# Altium schematic sheet Sheet.schdoc
size 249 x 199 mm
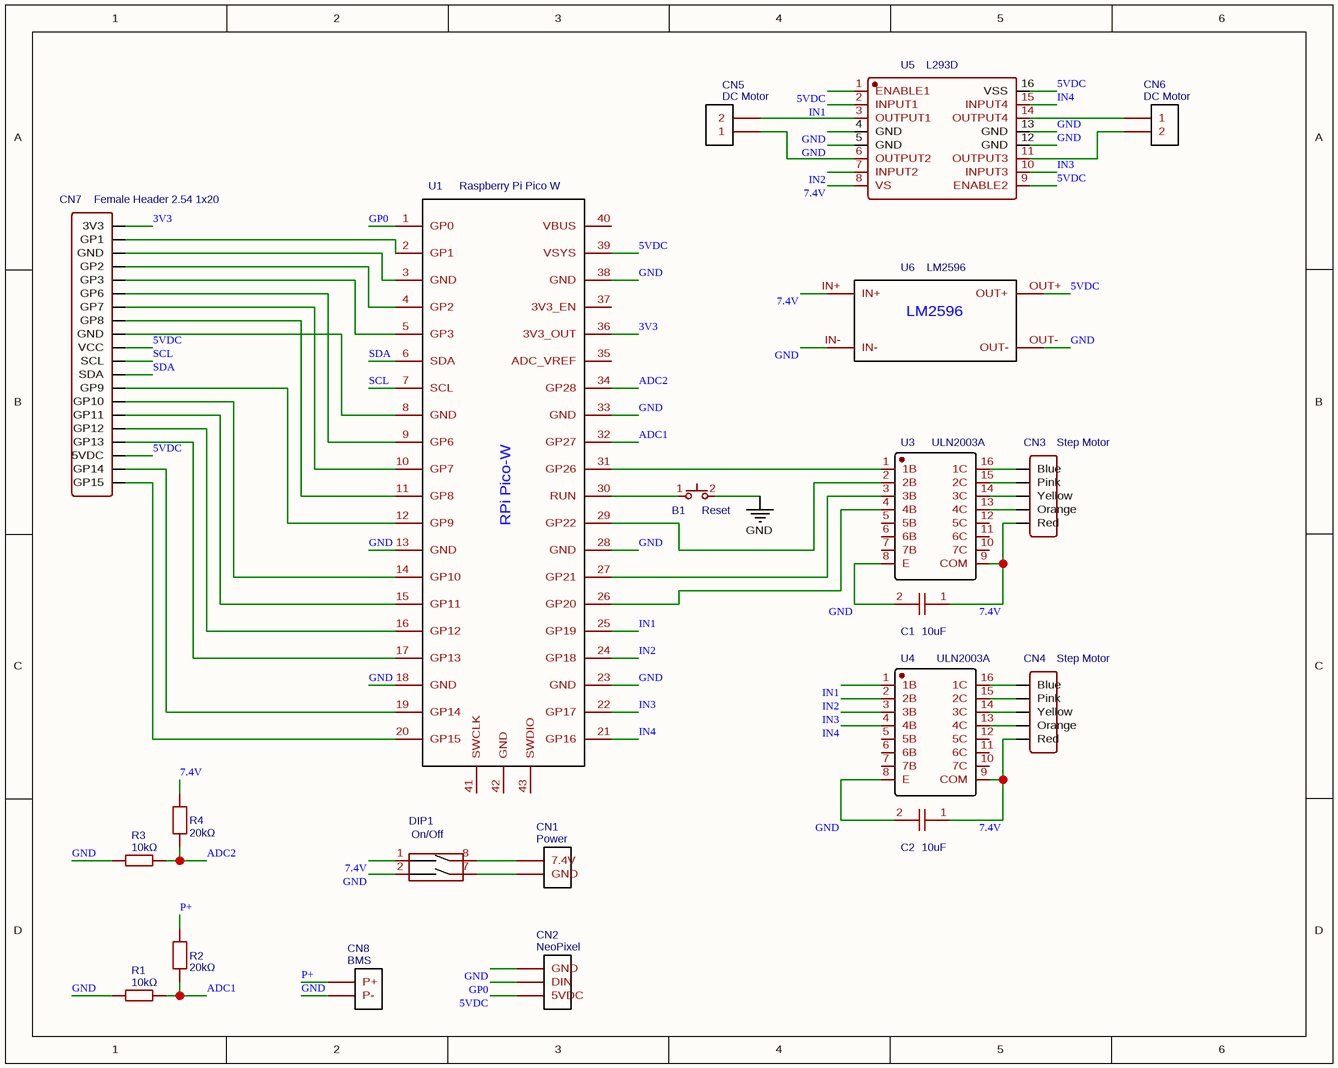
[diagram p0: Sheet.schdoc]

## Parts
B1  Reset  [BUTTON 2PIN]
C1  10uF  [10UF_16V]
C2  10uF  [10UF_16V]
CN1  Power  [JST-XH_2P-2.54MM]
CN2  NeoPixel  [JST-XH_3_JD]
CN3  Step Motor  [JST 2.54MM 5PIN]
CN4  Step Motor  [JST 2.54MM 5PIN]
CN5  DC Motor  [JST-XH_2P-2.54MM]
CN6  DC Motor  [JST-XH_2P-2.54MM]
CN7  Female Header 2.54 1x20  [HDR-TH_20P-P2.54-V-F]
CN8  BMS  [JST-XH_2P-2.54MM]
DIP1  On/Off  [DIP SWITCH 2 SWITCHES]
R1  10kΩ  [RES-TH_BD2.3-L6.5-P10.50-D0.5]
R2  20kΩ  [RES-TH_BD2.3-L6.5-P10.50-D0.5]
R3  10kΩ  [RES-TH_BD2.3-L6.5-P10.50-D0.5]
R4  20kΩ  [RES-TH_BD2.3-L6.5-P10.50-D0.5]
U1  Raspberry Pi Pico W  [RPI PICO-W]
U3  ULN2003A  [DIP-16_L19.2-W6.6-P2.54-LS7.6-BL]
U4  ULN2003A  [DIP-16_L19.2-W6.6-P2.54-LS7.6-BL]
U5  L293D  [DIP-16_L19.2-W6.6-P2.54-LS7.6-BL]
U6  LM2596  [DC-DC-STEP-DOWN-LM2596]

## Nets
GND: B1.2 C1.2 C2.2 CN2.1(GND) CN8.2(P-) DIP1.2 R1.1 R3.1 U1.13(GND) U1.18(GND) U1.23(GND) U1.28(GND) U1.33(GND) U1.38(GND) U3.8(E) U4.8(E) U5.4(GND) U5.5(GND) U5.12(GND) U5.13(GND) U6.IN- U6.OUT-
3V3: CN7.20(3V3) U1.36(3V3_OUT)
5VDC: CN2.3(5VDC) CN7.3(5VDC) CN7.11(VCC) U1.39(VSYS) U5.1(ENABLE1) U5.9(ENABLE2) U5.16(VSS) U6.OUT+
7.4V: C1.1 C2.1 CN3.1(Red) CN4.1(Red) DIP1.1 R4.2 U3.9(COM) U4.9(COM) U5.8(VS) U6.IN+
ADC1: R1.2 R2.1 U1.32(GP27)
ADC2: R3.2 R4.1 U1.34(GP28)
GP0: CN2.2(DIN) U1.1(GP0)
IN1: U1.25(GP19) U4.1(1B) U5.2(INPUT1)
IN2: U1.24(GP18) U4.2(2B) U5.7(INPUT2)
IN3: U1.22(GP17) U4.3(3B) U5.10(INPUT3)
IN4: U1.21(GP16) U4.4(4B) U5.15(INPUT4)
P+: CN8.1(P+) R2.2
SCL: CN7.10(SCL) U1.7(SCL)
SDA: CN7.9(SDA) U1.6(SDA)
NetB1_1: B1.1 U1.30(RUN)
NetCN1_1: CN1.1(7.4V) DIP1.8
NetCN1_2: CN1.2(GND) DIP1.7
NetCN3_2: CN3.2(Orange) U3.13(4C)
NetCN3_3: CN3.3(Yellow) U3.14(3C)
NetCN3_4: CN3.4(Pink) U3.15(2C)
NetCN3_5: CN3.5(Blue) U3.16(1C)
NetCN4_2: CN4.2(Orange) U4.13(4C)
NetCN4_3: CN4.3(Yellow) U4.14(3C)
NetCN4_4: CN4.4(Pink) U4.15(2C)
NetCN4_5: CN4.5(Blue) U4.16(1C)
NetCN5_1: CN5.1 U5.6(OUTPUT2)
NetCN5_2: CN5.2 U5.3(OUTPUT1)
NetCN6_1: CN6.1 U5.14(OUTPUT4)
NetCN6_2: CN6.2 U5.11(OUTPUT3)
NetCN7_1: CN7.1(GP15) U1.20(GP15)
NetCN7_2: CN7.2(GP14) U1.19(GP14)
NetCN7_4: CN7.4(GP13) U1.17(GP13)
NetCN7_5: CN7.5(GP12) U1.16(GP12)
NetCN7_6: CN7.6(GP11) U1.15(GP11)
NetCN7_7: CN7.7(GP10) U1.14(GP10)
NetCN7_8: CN7.8(GP9) U1.12(GP9)
NetCN7_12: CN7.12(GND) U1.8(GND)
NetCN7_13: CN7.13(GP8) U1.11(GP8)
NetCN7_14: CN7.14(GP7) U1.10(GP7)
NetCN7_15: CN7.15(GP6) U1.9(GP6)
NetCN7_16: CN7.16(GP3) U1.5(GP3)
NetCN7_17: CN7.17(GP2) U1.4(GP2)
NetCN7_18: CN7.18(GND) U1.3(GND)
NetCN7_19: CN7.19(GP1) U1.2(GP1)
NetU1_26: U1.26(GP20) U3.4(4B)
NetU1_27: U1.27(GP21) U3.3(3B)
NetU1_29: U1.29(GP22) U3.2(2B)
NetU1_31: U1.31(GP26) U3.1(1B)

Not connected (* = marked no-connect by the designer): U1 35(ADC_VREF) 37(3V3_EN) 40(VBUS) 41(SWCLK) 42(GND) 43(SWDIO); U3 5(5B) 6(6B) 7(7B) 10(7C) 11(6C) 12(5C); U4 5(5B) 6(6B) 7(7B) 10(7C) 11(6C) 12(5C)

## Library data of the parts
B1 = Reset: Contributor: Zayden; BOM_Supplier: addNewSupplier; spicePre: U; spiceSymbolName: button
C1 C2 = 10uF: BOM_Manufacturer: TDK; BOM_Manufacturer Part: FG26X7R1E106KRT00; Contributor: lcsc; BOM_Supplier: LCSC; BOM_Supplier Part: C3695070; Capacitance: 10uF; spicePre: U; spiceSymbolName: FG26X7R1E106KRT00
CN1 = Power: BOM_Manufacturer Part: JST; Contributor: amun; spicePre: J; spiceSymbolName: JST-XH_2P_2.54MM
CN2 = NeoPixel: BOM_Manufacturer Part: JST; Contributor: amun; spicePre: J; spiceSymbolName: JST-XH_3P_2.54MM
CN3 = Step Motor: Contributor: PuranSingh; spicePre: J; spiceSymbolName: JST 2.54mm 5pin
CN4 = Step Motor: Contributor: PuranSingh; Package Display: No; spicePre: J; spiceSymbolName: JST 2.54mm 5pin
CN5 CN6 = DC Motor: BOM_Manufacturer Part: JST; Contributor: amun; spicePre: J; spiceSymbolName: JST-XH_2P_2.54MM
CN7 = Female Header 2.54 1x20: BOM_Manufacturer: BOOMELE(博穆精密); BOM_Manufacturer Part: 2.54-1*20P母; BOM_Supplier: LCSC; BOM_Supplier Part: C50984; BOM_JLCPCB Part Class: Extended Part; spicePre: P; spiceSymbolName: Header-Female-2.54_1x20
CN8 = BMS: BOM_Manufacturer Part: JST; Contributor: amun; spicePre: J; spiceSymbolName: JST-XH_2P_2.54MM
DIP1 = On/Off: BOM_Manufacturer: DIP; BOM_Manufacturer Part: DIP switchEI-08; Contributor: michalsky; libConvert: Yes; BOM_Supplier: RS-Online; BOM_Supplier Part: C90019; Add into BOM: Yes; spicePre: D; spiceSymbolName: DIP SWITCH 2
R1 R3 = 10kΩ: BOM_Manufacturer: CCO(千志电子); BOM_Manufacturer Part: RI40-1/4W-10KΩ ±5% T; Resistance (Ohms): 10K; nameAlias: Resistance; Contributor: LCSC; BOM_Supplier: LCSC; BOM_Supplier Part: C136549; BOM_JLCPCB Part Class: Extended Part; spicePre: R; spiceSymbolName: RI40-1/4W-10KΩ ±5% T
R2 R4 = 20kΩ: BOM_Manufacturer: Huaxing Mechanical-Elec.; BOM_Manufacturer Part: MF1/4W-20KΩ±1%T52; nameAlias: Resistance (Ohms); Contributor: LCSC; BOM_Supplier: LCSC; BOM_Supplier Part: C714021; BOM_JLCPCB Part Class: Extended Part; Resistance: 20kΩ; spicePre: R; spiceSymbolName: MF1/4W-20KΩ±1%T52
U1 = Raspberry Pi Pico W: BOM_Manufacturer: Raspberry Pi Foundation; BOM_Manufacturer Part: Pi Pico; Contributor: Rovonius; BOM_Supplier: Raspberry Pi; BOM_Supplier Part: Raspberry Pi Pico-W; link: https://datasheets.raspberrypi.com/picow/pico-w-datasheet.pdf; spicePre: U; spiceSymbolName: RPi Pico-W
U3 U4 = ULN2003A: BOM_Manufacturer: TOSHIBA(东芝); BOM_Manufacturer Part: ULN2003APG; BOM_Supplier: LCSC; BOM_Supplier Part: C5251; BOM_JLCPCB Part Class: Extended Part; spicePre: U; spiceSymbolName: ULN2003APG
U5 = L293D: BOM_Manufacturer: HGSEMI; BOM_Manufacturer Part: L293DN; Contributor: LCSC; BOM_Supplier: LCSC; BOM_Supplier Part: C434590; BOM_JLCPCB Part Class: Extended Part; spicePre: U; spiceSymbolName: L293DN
U6 = LM2596: Contributor: Saad_Mazumder; spicePre: U; spiceSymbolName: LM2596